# Altium schematic sheet schematic.schdoc
size 810 x 364 mm
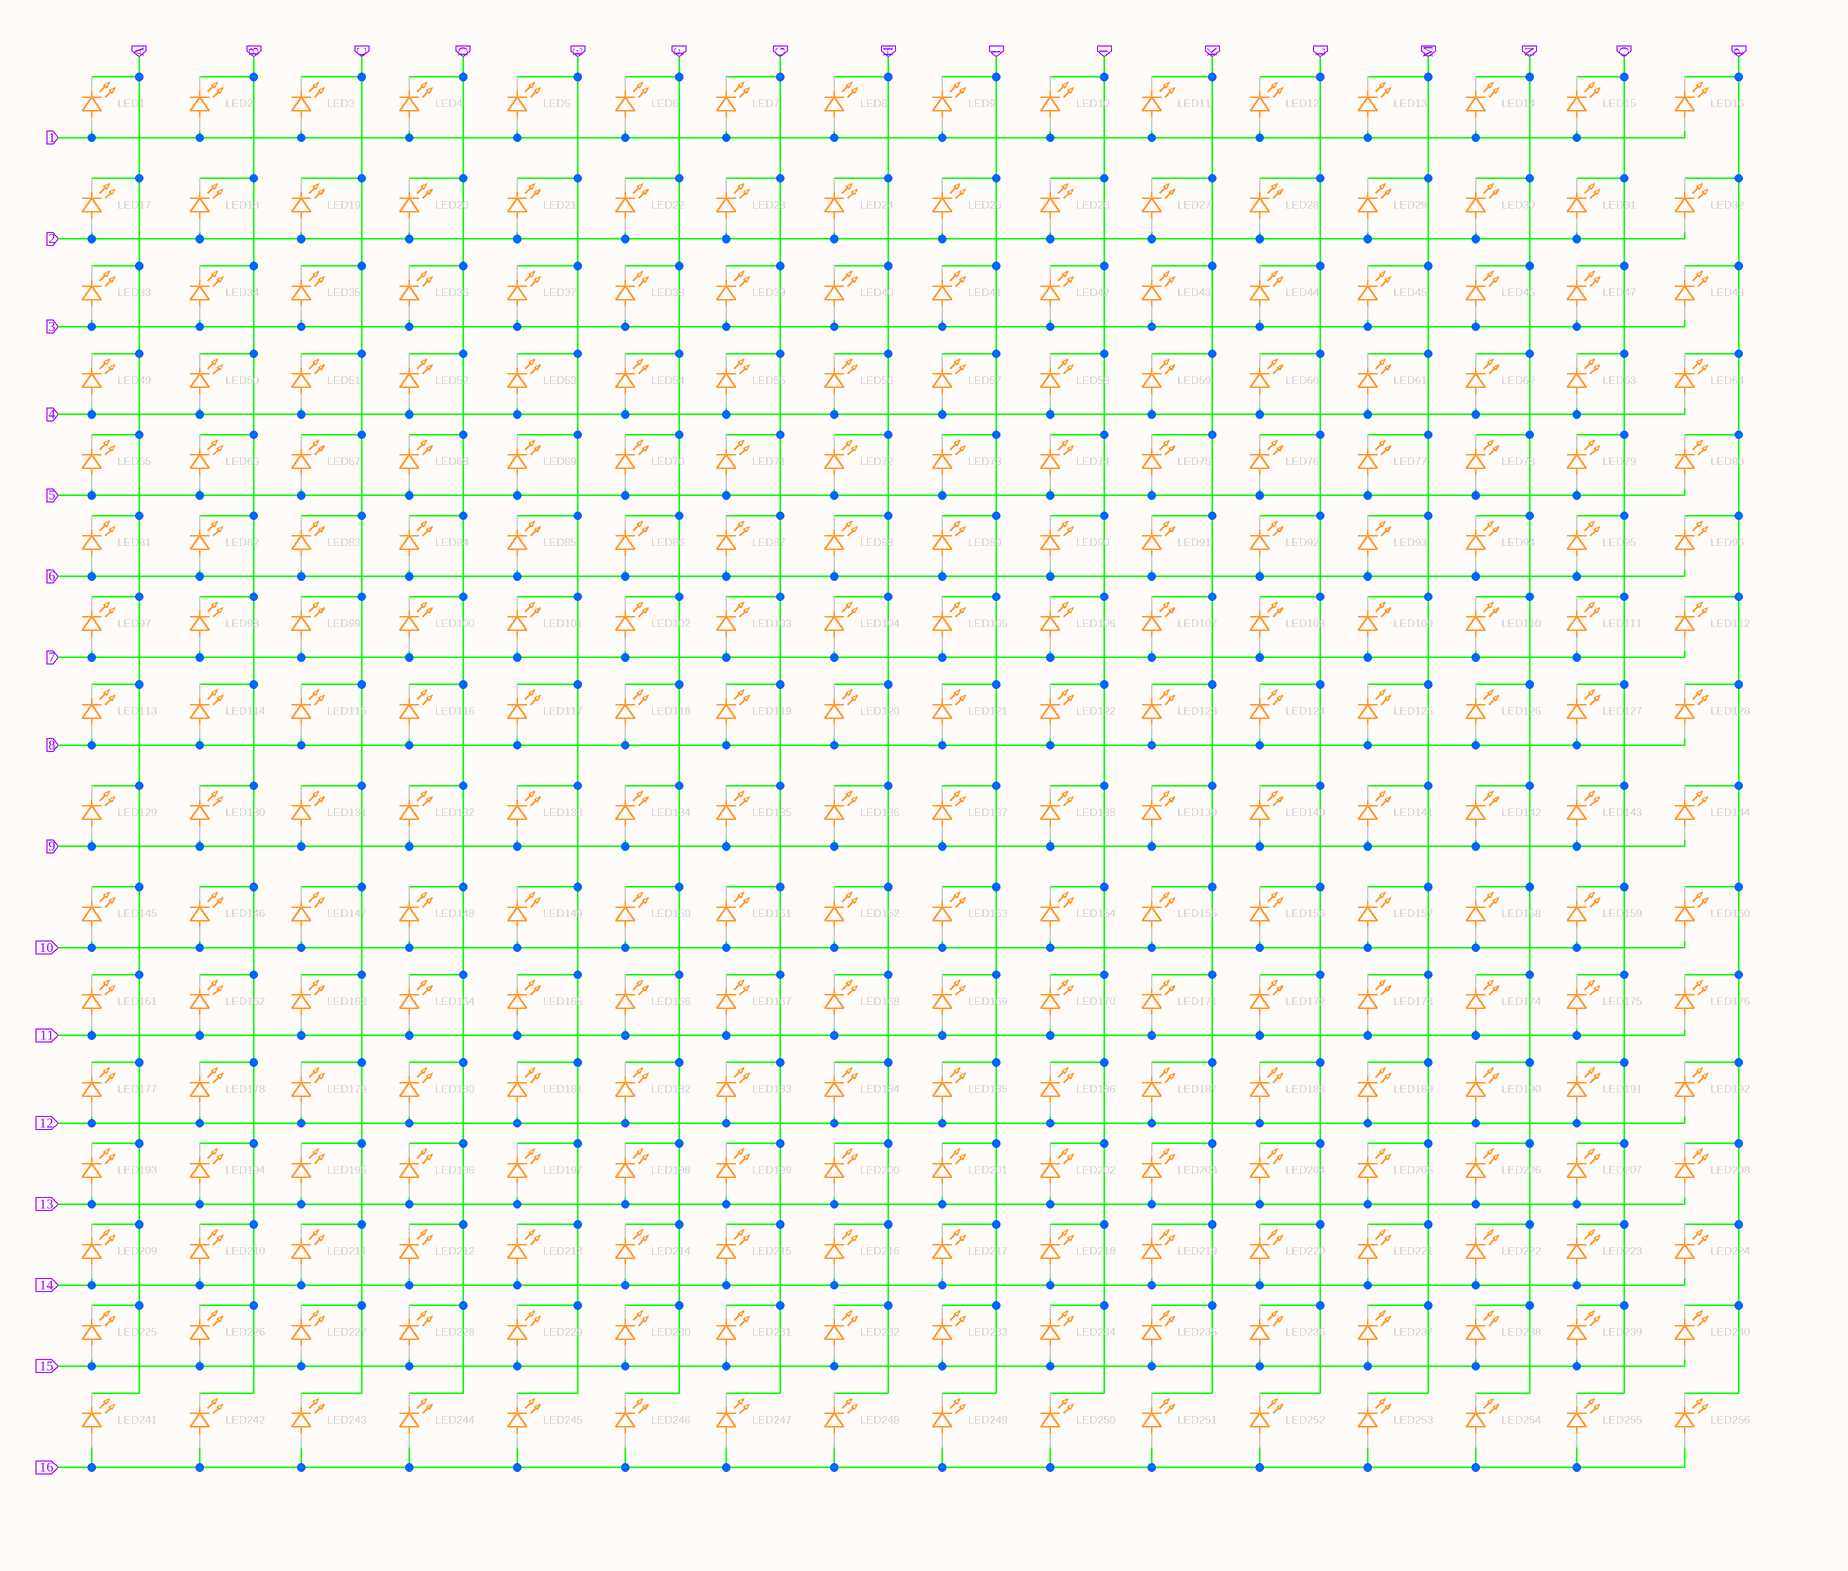
[diagram p0: schematic.schdoc, left]
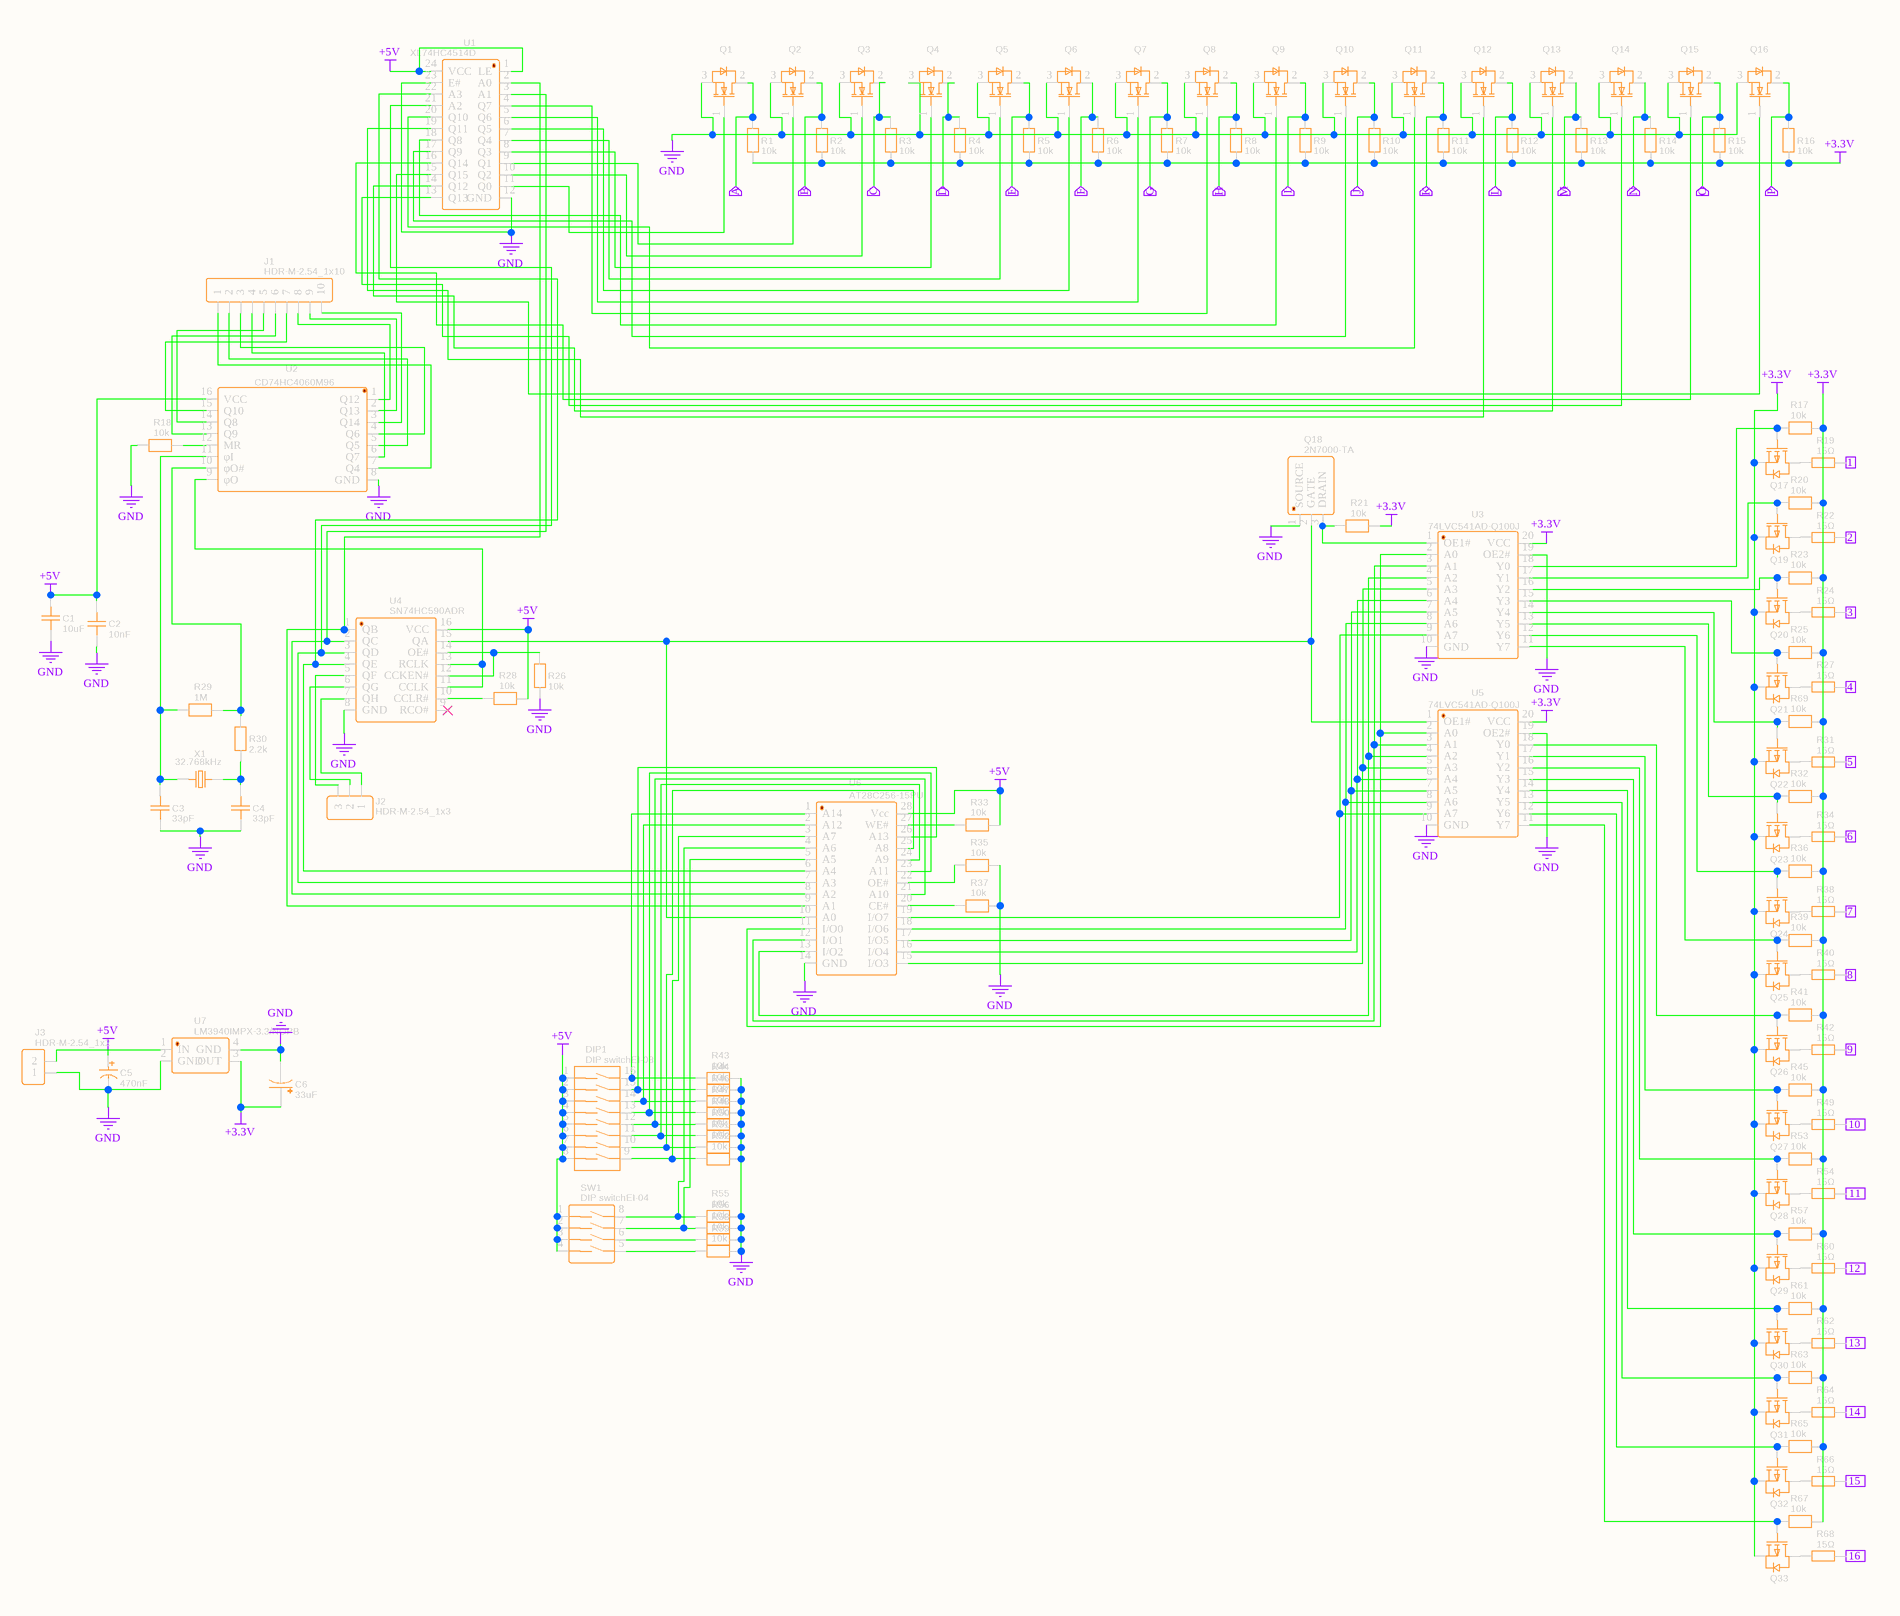
[diagram p1: schematic.schdoc, right]

## Parts
C1  10uF  [C1210]
C2  10nF  [C0805]
C3  33pF  [C0805]
C4  33pF  [C0805]
C5  470nF  [CAP-TH_BD4.0-P1.50-D0.8-FD]
C6  33uF  [CAP-TH_BD6.3-P2.50-D0.5-FD]
DIP1  DIP switchEI-08  [SW-TH_16P-L20.5-W6.0-P2.54]
J1  HDR-M-2.54_1x10  [HDR-M-2.54_1X10]
J2  HDR-M-2.54_1x3  [HDR-M-2.54_1X3]
J3  HDR-M-2.54_1x2  [HDR-M-2.54_1X2]
LED1  42-21A/GHC-YX1Y2N/1T  [LED-SMD_L3.2-W2.4-R_GREEN]  (value not drawn)
LED2  42-21A/GHC-YX1Y2N/1T  [LED-SMD_L3.2-W2.4-R_GREEN]  (value not drawn)
LED3  42-21A/GHC-YX1Y2N/1T  [LED-SMD_L3.2-W2.4-R_GREEN]  (value not drawn)
LED4  42-21A/GHC-YX1Y2N/1T  [LED-SMD_L3.2-W2.4-R_GREEN]  (value not drawn)
LED5  42-21A/GHC-YX1Y2N/1T  [LED-SMD_L3.2-W2.4-R_GREEN]  (value not drawn)
LED6  42-21A/GHC-YX1Y2N/1T  [LED-SMD_L3.2-W2.4-R_GREEN]  (value not drawn)
LED7  42-21A/GHC-YX1Y2N/1T  [LED-SMD_L3.2-W2.4-R_GREEN]  (value not drawn)
LED8  42-21A/GHC-YX1Y2N/1T  [LED-SMD_L3.2-W2.4-R_GREEN]  (value not drawn)
LED9  42-21A/GHC-YX1Y2N/1T  [LED-SMD_L3.2-W2.4-R_GREEN]  (value not drawn)
LED10  42-21A/GHC-YX1Y2N/1T  [LED-SMD_L3.2-W2.4-R_GREEN]  (value not drawn)
LED11  42-21A/GHC-YX1Y2N/1T  [LED-SMD_L3.2-W2.4-R_GREEN]  (value not drawn)
LED12  42-21A/GHC-YX1Y2N/1T  [LED-SMD_L3.2-W2.4-R_GREEN]  (value not drawn)
LED13  42-21A/GHC-YX1Y2N/1T  [LED-SMD_L3.2-W2.4-R_GREEN]  (value not drawn)
LED14  42-21A/GHC-YX1Y2N/1T  [LED-SMD_L3.2-W2.4-R_GREEN]  (value not drawn)
LED15  42-21A/GHC-YX1Y2N/1T  [LED-SMD_L3.2-W2.4-R_GREEN]  (value not drawn)
LED16  42-21A/GHC-YX1Y2N/1T  [LED-SMD_L3.2-W2.4-R_GREEN]  (value not drawn)
LED17  42-21A/GHC-YX1Y2N/1T  [LED-SMD_L3.2-W2.4-R_GREEN]  (value not drawn)
LED18  42-21A/GHC-YX1Y2N/1T  [LED-SMD_L3.2-W2.4-R_GREEN]  (value not drawn)
LED19  42-21A/GHC-YX1Y2N/1T  [LED-SMD_L3.2-W2.4-R_GREEN]  (value not drawn)
LED20  42-21A/GHC-YX1Y2N/1T  [LED-SMD_L3.2-W2.4-R_GREEN]  (value not drawn)
LED21  42-21A/GHC-YX1Y2N/1T  [LED-SMD_L3.2-W2.4-R_GREEN]  (value not drawn)
LED22  42-21A/GHC-YX1Y2N/1T  [LED-SMD_L3.2-W2.4-R_GREEN]  (value not drawn)
LED23  42-21A/GHC-YX1Y2N/1T  [LED-SMD_L3.2-W2.4-R_GREEN]  (value not drawn)
LED24  42-21A/GHC-YX1Y2N/1T  [LED-SMD_L3.2-W2.4-R_GREEN]  (value not drawn)
LED25  42-21A/GHC-YX1Y2N/1T  [LED-SMD_L3.2-W2.4-R_GREEN]  (value not drawn)
LED26  42-21A/GHC-YX1Y2N/1T  [LED-SMD_L3.2-W2.4-R_GREEN]  (value not drawn)
LED27  42-21A/GHC-YX1Y2N/1T  [LED-SMD_L3.2-W2.4-R_GREEN]  (value not drawn)
LED28  42-21A/GHC-YX1Y2N/1T  [LED-SMD_L3.2-W2.4-R_GREEN]  (value not drawn)
LED29  42-21A/GHC-YX1Y2N/1T  [LED-SMD_L3.2-W2.4-R_GREEN]  (value not drawn)
LED30  42-21A/GHC-YX1Y2N/1T  [LED-SMD_L3.2-W2.4-R_GREEN]  (value not drawn)
LED31  42-21A/GHC-YX1Y2N/1T  [LED-SMD_L3.2-W2.4-R_GREEN]  (value not drawn)
LED32  42-21A/GHC-YX1Y2N/1T  [LED-SMD_L3.2-W2.4-R_GREEN]  (value not drawn)
LED33  42-21A/GHC-YX1Y2N/1T  [LED-SMD_L3.2-W2.4-R_GREEN]  (value not drawn)
LED34  42-21A/GHC-YX1Y2N/1T  [LED-SMD_L3.2-W2.4-R_GREEN]  (value not drawn)
LED35  42-21A/GHC-YX1Y2N/1T  [LED-SMD_L3.2-W2.4-R_GREEN]  (value not drawn)
LED36  42-21A/GHC-YX1Y2N/1T  [LED-SMD_L3.2-W2.4-R_GREEN]  (value not drawn)
LED37  42-21A/GHC-YX1Y2N/1T  [LED-SMD_L3.2-W2.4-R_GREEN]  (value not drawn)
LED38  42-21A/GHC-YX1Y2N/1T  [LED-SMD_L3.2-W2.4-R_GREEN]  (value not drawn)
LED39  42-21A/GHC-YX1Y2N/1T  [LED-SMD_L3.2-W2.4-R_GREEN]  (value not drawn)
LED40  42-21A/GHC-YX1Y2N/1T  [LED-SMD_L3.2-W2.4-R_GREEN]  (value not drawn)
LED41  42-21A/GHC-YX1Y2N/1T  [LED-SMD_L3.2-W2.4-R_GREEN]  (value not drawn)
LED42  42-21A/GHC-YX1Y2N/1T  [LED-SMD_L3.2-W2.4-R_GREEN]  (value not drawn)
LED43  42-21A/GHC-YX1Y2N/1T  [LED-SMD_L3.2-W2.4-R_GREEN]  (value not drawn)
LED44  42-21A/GHC-YX1Y2N/1T  [LED-SMD_L3.2-W2.4-R_GREEN]  (value not drawn)
LED45  42-21A/GHC-YX1Y2N/1T  [LED-SMD_L3.2-W2.4-R_GREEN]  (value not drawn)
LED46  42-21A/GHC-YX1Y2N/1T  [LED-SMD_L3.2-W2.4-R_GREEN]  (value not drawn)
LED47  42-21A/GHC-YX1Y2N/1T  [LED-SMD_L3.2-W2.4-R_GREEN]  (value not drawn)
LED48  42-21A/GHC-YX1Y2N/1T  [LED-SMD_L3.2-W2.4-R_GREEN]  (value not drawn)
LED49  42-21A/GHC-YX1Y2N/1T  [LED-SMD_L3.2-W2.4-R_GREEN]  (value not drawn)
LED50  42-21A/GHC-YX1Y2N/1T  [LED-SMD_L3.2-W2.4-R_GREEN]  (value not drawn)
LED51  42-21A/GHC-YX1Y2N/1T  [LED-SMD_L3.2-W2.4-R_GREEN]  (value not drawn)
LED52  42-21A/GHC-YX1Y2N/1T  [LED-SMD_L3.2-W2.4-R_GREEN]  (value not drawn)
LED53  42-21A/GHC-YX1Y2N/1T  [LED-SMD_L3.2-W2.4-R_GREEN]  (value not drawn)
LED54  42-21A/GHC-YX1Y2N/1T  [LED-SMD_L3.2-W2.4-R_GREEN]  (value not drawn)
LED55  42-21A/GHC-YX1Y2N/1T  [LED-SMD_L3.2-W2.4-R_GREEN]  (value not drawn)
LED56  42-21A/GHC-YX1Y2N/1T  [LED-SMD_L3.2-W2.4-R_GREEN]  (value not drawn)
LED57  42-21A/GHC-YX1Y2N/1T  [LED-SMD_L3.2-W2.4-R_GREEN]  (value not drawn)
LED58  42-21A/GHC-YX1Y2N/1T  [LED-SMD_L3.2-W2.4-R_GREEN]  (value not drawn)
LED59  42-21A/GHC-YX1Y2N/1T  [LED-SMD_L3.2-W2.4-R_GREEN]  (value not drawn)
LED60  42-21A/GHC-YX1Y2N/1T  [LED-SMD_L3.2-W2.4-R_GREEN]  (value not drawn)
LED61  42-21A/GHC-YX1Y2N/1T  [LED-SMD_L3.2-W2.4-R_GREEN]  (value not drawn)
LED62  42-21A/GHC-YX1Y2N/1T  [LED-SMD_L3.2-W2.4-R_GREEN]  (value not drawn)
LED63  42-21A/GHC-YX1Y2N/1T  [LED-SMD_L3.2-W2.4-R_GREEN]  (value not drawn)
LED64  42-21A/GHC-YX1Y2N/1T  [LED-SMD_L3.2-W2.4-R_GREEN]  (value not drawn)
LED65  42-21A/GHC-YX1Y2N/1T  [LED-SMD_L3.2-W2.4-R_GREEN]  (value not drawn)
LED66  42-21A/GHC-YX1Y2N/1T  [LED-SMD_L3.2-W2.4-R_GREEN]  (value not drawn)
LED67  42-21A/GHC-YX1Y2N/1T  [LED-SMD_L3.2-W2.4-R_GREEN]  (value not drawn)
LED68  42-21A/GHC-YX1Y2N/1T  [LED-SMD_L3.2-W2.4-R_GREEN]  (value not drawn)
LED69  42-21A/GHC-YX1Y2N/1T  [LED-SMD_L3.2-W2.4-R_GREEN]  (value not drawn)
LED70  42-21A/GHC-YX1Y2N/1T  [LED-SMD_L3.2-W2.4-R_GREEN]  (value not drawn)
LED71  42-21A/GHC-YX1Y2N/1T  [LED-SMD_L3.2-W2.4-R_GREEN]  (value not drawn)
LED72  42-21A/GHC-YX1Y2N/1T  [LED-SMD_L3.2-W2.4-R_GREEN]  (value not drawn)
LED73  42-21A/GHC-YX1Y2N/1T  [LED-SMD_L3.2-W2.4-R_GREEN]  (value not drawn)
LED74  42-21A/GHC-YX1Y2N/1T  [LED-SMD_L3.2-W2.4-R_GREEN]  (value not drawn)
LED75  42-21A/GHC-YX1Y2N/1T  [LED-SMD_L3.2-W2.4-R_GREEN]  (value not drawn)
LED76  42-21A/GHC-YX1Y2N/1T  [LED-SMD_L3.2-W2.4-R_GREEN]  (value not drawn)
LED77  42-21A/GHC-YX1Y2N/1T  [LED-SMD_L3.2-W2.4-R_GREEN]  (value not drawn)
LED78  42-21A/GHC-YX1Y2N/1T  [LED-SMD_L3.2-W2.4-R_GREEN]  (value not drawn)
LED79  42-21A/GHC-YX1Y2N/1T  [LED-SMD_L3.2-W2.4-R_GREEN]  (value not drawn)
LED80  42-21A/GHC-YX1Y2N/1T  [LED-SMD_L3.2-W2.4-R_GREEN]  (value not drawn)
LED81  42-21A/GHC-YX1Y2N/1T  [LED-SMD_L3.2-W2.4-R_GREEN]  (value not drawn)
LED82  42-21A/GHC-YX1Y2N/1T  [LED-SMD_L3.2-W2.4-R_GREEN]  (value not drawn)
LED83  42-21A/GHC-YX1Y2N/1T  [LED-SMD_L3.2-W2.4-R_GREEN]  (value not drawn)
LED84  42-21A/GHC-YX1Y2N/1T  [LED-SMD_L3.2-W2.4-R_GREEN]  (value not drawn)
LED85  42-21A/GHC-YX1Y2N/1T  [LED-SMD_L3.2-W2.4-R_GREEN]  (value not drawn)
LED86  42-21A/GHC-YX1Y2N/1T  [LED-SMD_L3.2-W2.4-R_GREEN]  (value not drawn)
LED87  42-21A/GHC-YX1Y2N/1T  [LED-SMD_L3.2-W2.4-R_GREEN]  (value not drawn)
LED88  42-21A/GHC-YX1Y2N/1T  [LED-SMD_L3.2-W2.4-R_GREEN]  (value not drawn)
LED89  42-21A/GHC-YX1Y2N/1T  [LED-SMD_L3.2-W2.4-R_GREEN]  (value not drawn)
LED90  42-21A/GHC-YX1Y2N/1T  [LED-SMD_L3.2-W2.4-R_GREEN]  (value not drawn)
LED91  42-21A/GHC-YX1Y2N/1T  [LED-SMD_L3.2-W2.4-R_GREEN]  (value not drawn)
LED92  42-21A/GHC-YX1Y2N/1T  [LED-SMD_L3.2-W2.4-R_GREEN]  (value not drawn)
LED93  42-21A/GHC-YX1Y2N/1T  [LED-SMD_L3.2-W2.4-R_GREEN]  (value not drawn)
LED94  42-21A/GHC-YX1Y2N/1T  [LED-SMD_L3.2-W2.4-R_GREEN]  (value not drawn)
LED95  42-21A/GHC-YX1Y2N/1T  [LED-SMD_L3.2-W2.4-R_GREEN]  (value not drawn)
LED96  42-21A/GHC-YX1Y2N/1T  [LED-SMD_L3.2-W2.4-R_GREEN]  (value not drawn)
LED97  42-21A/GHC-YX1Y2N/1T  [LED-SMD_L3.2-W2.4-R_GREEN]  (value not drawn)
LED98  42-21A/GHC-YX1Y2N/1T  [LED-SMD_L3.2-W2.4-R_GREEN]  (value not drawn)
LED99  42-21A/GHC-YX1Y2N/1T  [LED-SMD_L3.2-W2.4-R_GREEN]  (value not drawn)
LED100  42-21A/GHC-YX1Y2N/1T  [LED-SMD_L3.2-W2.4-R_GREEN]  (value not drawn)
LED101  42-21A/GHC-YX1Y2N/1T  [LED-SMD_L3.2-W2.4-R_GREEN]  (value not drawn)
LED102  42-21A/GHC-YX1Y2N/1T  [LED-SMD_L3.2-W2.4-R_GREEN]  (value not drawn)
LED103  42-21A/GHC-YX1Y2N/1T  [LED-SMD_L3.2-W2.4-R_GREEN]  (value not drawn)
LED104  42-21A/GHC-YX1Y2N/1T  [LED-SMD_L3.2-W2.4-R_GREEN]  (value not drawn)
LED105  42-21A/GHC-YX1Y2N/1T  [LED-SMD_L3.2-W2.4-R_GREEN]  (value not drawn)
LED106  42-21A/GHC-YX1Y2N/1T  [LED-SMD_L3.2-W2.4-R_GREEN]  (value not drawn)
LED107  42-21A/GHC-YX1Y2N/1T  [LED-SMD_L3.2-W2.4-R_GREEN]  (value not drawn)
LED108  42-21A/GHC-YX1Y2N/1T  [LED-SMD_L3.2-W2.4-R_GREEN]  (value not drawn)
LED109  42-21A/GHC-YX1Y2N/1T  [LED-SMD_L3.2-W2.4-R_GREEN]  (value not drawn)
LED110  42-21A/GHC-YX1Y2N/1T  [LED-SMD_L3.2-W2.4-R_GREEN]  (value not drawn)
LED111  42-21A/GHC-YX1Y2N/1T  [LED-SMD_L3.2-W2.4-R_GREEN]  (value not drawn)
LED112  42-21A/GHC-YX1Y2N/1T  [LED-SMD_L3.2-W2.4-R_GREEN]  (value not drawn)
LED113  42-21A/GHC-YX1Y2N/1T  [LED-SMD_L3.2-W2.4-R_GREEN]  (value not drawn)
LED114  42-21A/GHC-YX1Y2N/1T  [LED-SMD_L3.2-W2.4-R_GREEN]  (value not drawn)
LED115  42-21A/GHC-YX1Y2N/1T  [LED-SMD_L3.2-W2.4-R_GREEN]  (value not drawn)
LED116  42-21A/GHC-YX1Y2N/1T  [LED-SMD_L3.2-W2.4-R_GREEN]  (value not drawn)
LED117  42-21A/GHC-YX1Y2N/1T  [LED-SMD_L3.2-W2.4-R_GREEN]  (value not drawn)
LED118  42-21A/GHC-YX1Y2N/1T  [LED-SMD_L3.2-W2.4-R_GREEN]  (value not drawn)
LED119  42-21A/GHC-YX1Y2N/1T  [LED-SMD_L3.2-W2.4-R_GREEN]  (value not drawn)
LED120  42-21A/GHC-YX1Y2N/1T  [LED-SMD_L3.2-W2.4-R_GREEN]  (value not drawn)
LED121  42-21A/GHC-YX1Y2N/1T  [LED-SMD_L3.2-W2.4-R_GREEN]  (value not drawn)
LED122  42-21A/GHC-YX1Y2N/1T  [LED-SMD_L3.2-W2.4-R_GREEN]  (value not drawn)
LED123  42-21A/GHC-YX1Y2N/1T  [LED-SMD_L3.2-W2.4-R_GREEN]  (value not drawn)
LED124  42-21A/GHC-YX1Y2N/1T  [LED-SMD_L3.2-W2.4-R_GREEN]  (value not drawn)
LED125  42-21A/GHC-YX1Y2N/1T  [LED-SMD_L3.2-W2.4-R_GREEN]  (value not drawn)
LED126  42-21A/GHC-YX1Y2N/1T  [LED-SMD_L3.2-W2.4-R_GREEN]  (value not drawn)
LED127  42-21A/GHC-YX1Y2N/1T  [LED-SMD_L3.2-W2.4-R_GREEN]  (value not drawn)
LED128  42-21A/GHC-YX1Y2N/1T  [LED-SMD_L3.2-W2.4-R_GREEN]  (value not drawn)
LED129  42-21A/GHC-YX1Y2N/1T  [LED-SMD_L3.2-W2.4-R_GREEN]  (value not drawn)
LED130  42-21A/GHC-YX1Y2N/1T  [LED-SMD_L3.2-W2.4-R_GREEN]  (value not drawn)
LED131  42-21A/GHC-YX1Y2N/1T  [LED-SMD_L3.2-W2.4-R_GREEN]  (value not drawn)
LED132  42-21A/GHC-YX1Y2N/1T  [LED-SMD_L3.2-W2.4-R_GREEN]  (value not drawn)
LED133  42-21A/GHC-YX1Y2N/1T  [LED-SMD_L3.2-W2.4-R_GREEN]  (value not drawn)
LED134  42-21A/GHC-YX1Y2N/1T  [LED-SMD_L3.2-W2.4-R_GREEN]  (value not drawn)
LED135  42-21A/GHC-YX1Y2N/1T  [LED-SMD_L3.2-W2.4-R_GREEN]  (value not drawn)
LED136  42-21A/GHC-YX1Y2N/1T  [LED-SMD_L3.2-W2.4-R_GREEN]  (value not drawn)
LED137  42-21A/GHC-YX1Y2N/1T  [LED-SMD_L3.2-W2.4-R_GREEN]  (value not drawn)
LED138  42-21A/GHC-YX1Y2N/1T  [LED-SMD_L3.2-W2.4-R_GREEN]  (value not drawn)
LED139  42-21A/GHC-YX1Y2N/1T  [LED-SMD_L3.2-W2.4-R_GREEN]  (value not drawn)
LED140  42-21A/GHC-YX1Y2N/1T  [LED-SMD_L3.2-W2.4-R_GREEN]  (value not drawn)
LED141  42-21A/GHC-YX1Y2N/1T  [LED-SMD_L3.2-W2.4-R_GREEN]  (value not drawn)
LED142  42-21A/GHC-YX1Y2N/1T  [LED-SMD_L3.2-W2.4-R_GREEN]  (value not drawn)
LED143  42-21A/GHC-YX1Y2N/1T  [LED-SMD_L3.2-W2.4-R_GREEN]  (value not drawn)
LED144  42-21A/GHC-YX1Y2N/1T  [LED-SMD_L3.2-W2.4-R_GREEN]  (value not drawn)
LED145  42-21A/GHC-YX1Y2N/1T  [LED-SMD_L3.2-W2.4-R_GREEN]  (value not drawn)
LED146  42-21A/GHC-YX1Y2N/1T  [LED-SMD_L3.2-W2.4-R_GREEN]  (value not drawn)
LED147  42-21A/GHC-YX1Y2N/1T  [LED-SMD_L3.2-W2.4-R_GREEN]  (value not drawn)
LED148  42-21A/GHC-YX1Y2N/1T  [LED-SMD_L3.2-W2.4-R_GREEN]  (value not drawn)
LED149  42-21A/GHC-YX1Y2N/1T  [LED-SMD_L3.2-W2.4-R_GREEN]  (value not drawn)
LED150  42-21A/GHC-YX1Y2N/1T  [LED-SMD_L3.2-W2.4-R_GREEN]  (value not drawn)
LED151  42-21A/GHC-YX1Y2N/1T  [LED-SMD_L3.2-W2.4-R_GREEN]  (value not drawn)
LED152  42-21A/GHC-YX1Y2N/1T  [LED-SMD_L3.2-W2.4-R_GREEN]  (value not drawn)
LED153  42-21A/GHC-YX1Y2N/1T  [LED-SMD_L3.2-W2.4-R_GREEN]  (value not drawn)
LED154  42-21A/GHC-YX1Y2N/1T  [LED-SMD_L3.2-W2.4-R_GREEN]  (value not drawn)
LED155  42-21A/GHC-YX1Y2N/1T  [LED-SMD_L3.2-W2.4-R_GREEN]  (value not drawn)
LED156  42-21A/GHC-YX1Y2N/1T  [LED-SMD_L3.2-W2.4-R_GREEN]  (value not drawn)
LED157  42-21A/GHC-YX1Y2N/1T  [LED-SMD_L3.2-W2.4-R_GREEN]  (value not drawn)
LED158  42-21A/GHC-YX1Y2N/1T  [LED-SMD_L3.2-W2.4-R_GREEN]  (value not drawn)
LED159  42-21A/GHC-YX1Y2N/1T  [LED-SMD_L3.2-W2.4-R_GREEN]  (value not drawn)
LED160  42-21A/GHC-YX1Y2N/1T  [LED-SMD_L3.2-W2.4-R_GREEN]  (value not drawn)
LED161  42-21A/GHC-YX1Y2N/1T  [LED-SMD_L3.2-W2.4-R_GREEN]  (value not drawn)
LED162  42-21A/GHC-YX1Y2N/1T  [LED-SMD_L3.2-W2.4-R_GREEN]  (value not drawn)
LED163  42-21A/GHC-YX1Y2N/1T  [LED-SMD_L3.2-W2.4-R_GREEN]  (value not drawn)
LED164  42-21A/GHC-YX1Y2N/1T  [LED-SMD_L3.2-W2.4-R_GREEN]  (value not drawn)
LED165  42-21A/GHC-YX1Y2N/1T  [LED-SMD_L3.2-W2.4-R_GREEN]  (value not drawn)
LED166  42-21A/GHC-YX1Y2N/1T  [LED-SMD_L3.2-W2.4-R_GREEN]  (value not drawn)
LED167  42-21A/GHC-YX1Y2N/1T  [LED-SMD_L3.2-W2.4-R_GREEN]  (value not drawn)
LED168  42-21A/GHC-YX1Y2N/1T  [LED-SMD_L3.2-W2.4-R_GREEN]  (value not drawn)
LED169  42-21A/GHC-YX1Y2N/1T  [LED-SMD_L3.2-W2.4-R_GREEN]  (value not drawn)
LED170  42-21A/GHC-YX1Y2N/1T  [LED-SMD_L3.2-W2.4-R_GREEN]  (value not drawn)
LED171  42-21A/GHC-YX1Y2N/1T  [LED-SMD_L3.2-W2.4-R_GREEN]  (value not drawn)
LED172  42-21A/GHC-YX1Y2N/1T  [LED-SMD_L3.2-W2.4-R_GREEN]  (value not drawn)
LED173  42-21A/GHC-YX1Y2N/1T  [LED-SMD_L3.2-W2.4-R_GREEN]  (value not drawn)
LED174  42-21A/GHC-YX1Y2N/1T  [LED-SMD_L3.2-W2.4-R_GREEN]  (value not drawn)
LED175  42-21A/GHC-YX1Y2N/1T  [LED-SMD_L3.2-W2.4-R_GREEN]  (value not drawn)
LED176  42-21A/GHC-YX1Y2N/1T  [LED-SMD_L3.2-W2.4-R_GREEN]  (value not drawn)
LED177  42-21A/GHC-YX1Y2N/1T  [LED-SMD_L3.2-W2.4-R_GREEN]  (value not drawn)
LED178  42-21A/GHC-YX1Y2N/1T  [LED-SMD_L3.2-W2.4-R_GREEN]  (value not drawn)
LED179  42-21A/GHC-YX1Y2N/1T  [LED-SMD_L3.2-W2.4-R_GREEN]  (value not drawn)
LED180  42-21A/GHC-YX1Y2N/1T  [LED-SMD_L3.2-W2.4-R_GREEN]  (value not drawn)
LED181  42-21A/GHC-YX1Y2N/1T  [LED-SMD_L3.2-W2.4-R_GREEN]  (value not drawn)
LED182  42-21A/GHC-YX1Y2N/1T  [LED-SMD_L3.2-W2.4-R_GREEN]  (value not drawn)
LED183  42-21A/GHC-YX1Y2N/1T  [LED-SMD_L3.2-W2.4-R_GREEN]  (value not drawn)
LED184  42-21A/GHC-YX1Y2N/1T  [LED-SMD_L3.2-W2.4-R_GREEN]  (value not drawn)
LED185  42-21A/GHC-YX1Y2N/1T  [LED-SMD_L3.2-W2.4-R_GREEN]  (value not drawn)
LED186  42-21A/GHC-YX1Y2N/1T  [LED-SMD_L3.2-W2.4-R_GREEN]  (value not drawn)
LED187  42-21A/GHC-YX1Y2N/1T  [LED-SMD_L3.2-W2.4-R_GREEN]  (value not drawn)
LED188  42-21A/GHC-YX1Y2N/1T  [LED-SMD_L3.2-W2.4-R_GREEN]  (value not drawn)
LED189  42-21A/GHC-YX1Y2N/1T  [LED-SMD_L3.2-W2.4-R_GREEN]  (value not drawn)
LED190  42-21A/GHC-YX1Y2N/1T  [LED-SMD_L3.2-W2.4-R_GREEN]  (value not drawn)
LED191  42-21A/GHC-YX1Y2N/1T  [LED-SMD_L3.2-W2.4-R_GREEN]  (value not drawn)
LED192  42-21A/GHC-YX1Y2N/1T  [LED-SMD_L3.2-W2.4-R_GREEN]  (value not drawn)
LED193  42-21A/GHC-YX1Y2N/1T  [LED-SMD_L3.2-W2.4-R_GREEN]  (value not drawn)
LED194  42-21A/GHC-YX1Y2N/1T  [LED-SMD_L3.2-W2.4-R_GREEN]  (value not drawn)
LED195  42-21A/GHC-YX1Y2N/1T  [LED-SMD_L3.2-W2.4-R_GREEN]  (value not drawn)
LED196  42-21A/GHC-YX1Y2N/1T  [LED-SMD_L3.2-W2.4-R_GREEN]  (value not drawn)
LED197  42-21A/GHC-YX1Y2N/1T  [LED-SMD_L3.2-W2.4-R_GREEN]  (value not drawn)
LED198  42-21A/GHC-YX1Y2N/1T  [LED-SMD_L3.2-W2.4-R_GREEN]  (value not drawn)
LED199  42-21A/GHC-YX1Y2N/1T  [LED-SMD_L3.2-W2.4-R_GREEN]  (value not drawn)
LED200  42-21A/GHC-YX1Y2N/1T  [LED-SMD_L3.2-W2.4-R_GREEN]  (value not drawn)
LED201  42-21A/GHC-YX1Y2N/1T  [LED-SMD_L3.2-W2.4-R_GREEN]  (value not drawn)
LED202  42-21A/GHC-YX1Y2N/1T  [LED-SMD_L3.2-W2.4-R_GREEN]  (value not drawn)
LED203  42-21A/GHC-YX1Y2N/1T  [LED-SMD_L3.2-W2.4-R_GREEN]  (value not drawn)
LED204  42-21A/GHC-YX1Y2N/1T  [LED-SMD_L3.2-W2.4-R_GREEN]  (value not drawn)
LED205  42-21A/GHC-YX1Y2N/1T  [LED-SMD_L3.2-W2.4-R_GREEN]  (value not drawn)
LED206  42-21A/GHC-YX1Y2N/1T  [LED-SMD_L3.2-W2.4-R_GREEN]  (value not drawn)
LED207  42-21A/GHC-YX1Y2N/1T  [LED-SMD_L3.2-W2.4-R_GREEN]  (value not drawn)
LED208  42-21A/GHC-YX1Y2N/1T  [LED-SMD_L3.2-W2.4-R_GREEN]  (value not drawn)
LED209  42-21A/GHC-YX1Y2N/1T  [LED-SMD_L3.2-W2.4-R_GREEN]  (value not drawn)
LED210  42-21A/GHC-YX1Y2N/1T  [LED-SMD_L3.2-W2.4-R_GREEN]  (value not drawn)
LED211  42-21A/GHC-YX1Y2N/1T  [LED-SMD_L3.2-W2.4-R_GREEN]  (value not drawn)
LED212  42-21A/GHC-YX1Y2N/1T  [LED-SMD_L3.2-W2.4-R_GREEN]  (value not drawn)
LED213  42-21A/GHC-YX1Y2N/1T  [LED-SMD_L3.2-W2.4-R_GREEN]  (value not drawn)
LED214  42-21A/GHC-YX1Y2N/1T  [LED-SMD_L3.2-W2.4-R_GREEN]  (value not drawn)
LED215  42-21A/GHC-YX1Y2N/1T  [LED-SMD_L3.2-W2.4-R_GREEN]  (value not drawn)
LED216  42-21A/GHC-YX1Y2N/1T  [LED-SMD_L3.2-W2.4-R_GREEN]  (value not drawn)
LED217  42-21A/GHC-YX1Y2N/1T  [LED-SMD_L3.2-W2.4-R_GREEN]  (value not drawn)
LED218  42-21A/GHC-YX1Y2N/1T  [LED-SMD_L3.2-W2.4-R_GREEN]  (value not drawn)
LED219  42-21A/GHC-YX1Y2N/1T  [LED-SMD_L3.2-W2.4-R_GREEN]  (value not drawn)
LED220  42-21A/GHC-YX1Y2N/1T  [LED-SMD_L3.2-W2.4-R_GREEN]  (value not drawn)
LED221  42-21A/GHC-YX1Y2N/1T  [LED-SMD_L3.2-W2.4-R_GREEN]  (value not drawn)
LED222  42-21A/GHC-YX1Y2N/1T  [LED-SMD_L3.2-W2.4-R_GREEN]  (value not drawn)
LED223  42-21A/GHC-YX1Y2N/1T  [LED-SMD_L3.2-W2.4-R_GREEN]  (value not drawn)
LED224  42-21A/GHC-YX1Y2N/1T  [LED-SMD_L3.2-W2.4-R_GREEN]  (value not drawn)
LED225  42-21A/GHC-YX1Y2N/1T  [LED-SMD_L3.2-W2.4-R_GREEN]  (value not drawn)
LED226  42-21A/GHC-YX1Y2N/1T  [LED-SMD_L3.2-W2.4-R_GREEN]  (value not drawn)
LED227  42-21A/GHC-YX1Y2N/1T  [LED-SMD_L3.2-W2.4-R_GREEN]  (value not drawn)
LED228  42-21A/GHC-YX1Y2N/1T  [LED-SMD_L3.2-W2.4-R_GREEN]  (value not drawn)
LED229  42-21A/GHC-YX1Y2N/1T  [LED-SMD_L3.2-W2.4-R_GREEN]  (value not drawn)
LED230  42-21A/GHC-YX1Y2N/1T  [LED-SMD_L3.2-W2.4-R_GREEN]  (value not drawn)
LED231  42-21A/GHC-YX1Y2N/1T  [LED-SMD_L3.2-W2.4-R_GREEN]  (value not drawn)
LED232  42-21A/GHC-YX1Y2N/1T  [LED-SMD_L3.2-W2.4-R_GREEN]  (value not drawn)
LED233  42-21A/GHC-YX1Y2N/1T  [LED-SMD_L3.2-W2.4-R_GREEN]  (value not drawn)
LED234  42-21A/GHC-YX1Y2N/1T  [LED-SMD_L3.2-W2.4-R_GREEN]  (value not drawn)
LED235  42-21A/GHC-YX1Y2N/1T  [LED-SMD_L3.2-W2.4-R_GREEN]  (value not drawn)
LED236  42-21A/GHC-YX1Y2N/1T  [LED-SMD_L3.2-W2.4-R_GREEN]  (value not drawn)
LED237  42-21A/GHC-YX1Y2N/1T  [LED-SMD_L3.2-W2.4-R_GREEN]  (value not drawn)
LED238  42-21A/GHC-YX1Y2N/1T  [LED-SMD_L3.2-W2.4-R_GREEN]  (value not drawn)
LED239  42-21A/GHC-YX1Y2N/1T  [LED-SMD_L3.2-W2.4-R_GREEN]  (value not drawn)
LED240  42-21A/GHC-YX1Y2N/1T  [LED-SMD_L3.2-W2.4-R_GREEN]  (value not drawn)
LED241  42-21A/GHC-YX1Y2N/1T  [LED-SMD_L3.2-W2.4-R_GREEN]  (value not drawn)
LED242  42-21A/GHC-YX1Y2N/1T  [LED-SMD_L3.2-W2.4-R_GREEN]  (value not drawn)
LED243  42-21A/GHC-YX1Y2N/1T  [LED-SMD_L3.2-W2.4-R_GREEN]  (value not drawn)
LED244  42-21A/GHC-YX1Y2N/1T  [LED-SMD_L3.2-W2.4-R_GREEN]  (value not drawn)
LED245  42-21A/GHC-YX1Y2N/1T  [LED-SMD_L3.2-W2.4-R_GREEN]  (value not drawn)
LED246  42-21A/GHC-YX1Y2N/1T  [LED-SMD_L3.2-W2.4-R_GREEN]  (value not drawn)
LED247  42-21A/GHC-YX1Y2N/1T  [LED-SMD_L3.2-W2.4-R_GREEN]  (value not drawn)
LED248  42-21A/GHC-YX1Y2N/1T  [LED-SMD_L3.2-W2.4-R_GREEN]  (value not drawn)
LED249  42-21A/GHC-YX1Y2N/1T  [LED-SMD_L3.2-W2.4-R_GREEN]  (value not drawn)
LED250  42-21A/GHC-YX1Y2N/1T  [LED-SMD_L3.2-W2.4-R_GREEN]  (value not drawn)
LED251  42-21A/GHC-YX1Y2N/1T  [LED-SMD_L3.2-W2.4-R_GREEN]  (value not drawn)
LED252  42-21A/GHC-YX1Y2N/1T  [LED-SMD_L3.2-W2.4-R_GREEN]  (value not drawn)
LED253  42-21A/GHC-YX1Y2N/1T  [LED-SMD_L3.2-W2.4-R_GREEN]  (value not drawn)
LED254  42-21A/GHC-YX1Y2N/1T  [LED-SMD_L3.2-W2.4-R_GREEN]  (value not drawn)
LED255  42-21A/GHC-YX1Y2N/1T  [LED-SMD_L3.2-W2.4-R_GREEN]  (value not drawn)
LED256  42-21A/GHC-YX1Y2N/1T  [LED-SMD_L3.2-W2.4-R_GREEN]  (value not drawn)
Q1  IRLZ44NPBF-MNS  [TO-220-3_L10.0-W4.5-P2.54-L]  (value not drawn)
Q2  IRLZ44NPBF-MNS  [TO-220-3_L10.0-W4.5-P2.54-L]  (value not drawn)
Q3  IRLZ44NPBF-MNS  [TO-220-3_L10.0-W4.5-P2.54-L]  (value not drawn)
Q4  IRLZ44NPBF-MNS  [TO-220-3_L10.0-W4.5-P2.54-L]  (value not drawn)
Q5  IRLZ44NPBF-MNS  [TO-220-3_L10.0-W4.5-P2.54-L]  (value not drawn)
Q6  IRLZ44NPBF-MNS  [TO-220-3_L10.0-W4.5-P2.54-L]  (value not drawn)
Q7  IRLZ44NPBF-MNS  [TO-220-3_L10.0-W4.5-P2.54-L]  (value not drawn)
Q8  IRLZ44NPBF-MNS  [TO-220-3_L10.0-W4.5-P2.54-L]  (value not drawn)
Q9  IRLZ44NPBF-MNS  [TO-220-3_L10.0-W4.5-P2.54-L]  (value not drawn)
Q10  IRLZ44NPBF-MNS  [TO-220-3_L10.0-W4.5-P2.54-L]  (value not drawn)
Q11  IRLZ44NPBF-MNS  [TO-220-3_L10.0-W4.5-P2.54-L]  (value not drawn)
Q12  IRLZ44NPBF-MNS  [TO-220-3_L10.0-W4.5-P2.54-L]  (value not drawn)
Q13  IRLZ44NPBF-MNS  [TO-220-3_L10.0-W4.5-P2.54-L]  (value not drawn)
Q14  IRLZ44NPBF-MNS  [TO-220-3_L10.0-W4.5-P2.54-L]  (value not drawn)
Q15  IRLZ44NPBF-MNS  [TO-220-3_L10.0-W4.5-P2.54-L]  (value not drawn)
Q16  IRLZ44NPBF-MNS  [TO-220-3_L10.0-W4.5-P2.54-L]  (value not drawn)
Q17  AO3401CI-ES  [SOT-23-3_L2.9-W1.3-P1.90-LS2.4-BR]  (value not drawn)
Q18  2N7000-TA  [TO-92-3_L4.5-W3.5-P1.27-L]
Q19  AO3401CI-ES  [SOT-23-3_L2.9-W1.3-P1.90-LS2.4-BR]  (value not drawn)
Q20  AO3401CI-ES  [SOT-23-3_L2.9-W1.3-P1.90-LS2.4-BR]  (value not drawn)
Q21  AO3401CI-ES  [SOT-23-3_L2.9-W1.3-P1.90-LS2.4-BR]  (value not drawn)
Q22  AO3401CI-ES  [SOT-23-3_L2.9-W1.3-P1.90-LS2.4-BR]  (value not drawn)
Q23  AO3401CI-ES  [SOT-23-3_L2.9-W1.3-P1.90-LS2.4-BR]  (value not drawn)
Q24  AO3401CI-ES  [SOT-23-3_L2.9-W1.3-P1.90-LS2.4-BR]  (value not drawn)
Q25  AO3401CI-ES  [SOT-23-3_L2.9-W1.3-P1.90-LS2.4-BR]  (value not drawn)
Q26  AO3401CI-ES  [SOT-23-3_L2.9-W1.3-P1.90-LS2.4-BR]  (value not drawn)
Q27  AO3401CI-ES  [SOT-23-3_L2.9-W1.3-P1.90-LS2.4-BR]  (value not drawn)
Q28  AO3401CI-ES  [SOT-23-3_L2.9-W1.3-P1.90-LS2.4-BR]  (value not drawn)
Q29  AO3401CI-ES  [SOT-23-3_L2.9-W1.3-P1.90-LS2.4-BR]  (value not drawn)
Q30  AO3401CI-ES  [SOT-23-3_L2.9-W1.3-P1.90-LS2.4-BR]  (value not drawn)
Q31  AO3401CI-ES  [SOT-23-3_L2.9-W1.3-P1.90-LS2.4-BR]  (value not drawn)
Q32  AO3401CI-ES  [SOT-23-3_L2.9-W1.3-P1.90-LS2.4-BR]  (value not drawn)
Q33  AO3401CI-ES  [SOT-23-3_L2.9-W1.3-P1.90-LS2.4-BR]  (value not drawn)
R1  10k  [R0603]
R2  10k  [R0603]
R3  10k  [R0603]
R4  10k  [R0603]
R5  10k  [R0603]
R6  10k  [R0603]
R7  10k  [R0603]
R8  10k  [R0603]
R9  10k  [R0603]
R10  10k  [R0603]
R11  10k  [R0603]
R12  10k  [R0603]
R13  10k  [R0603]
R14  10k  [R0603]
R15  10k  [R0603]
R16  10k  [R0603]
R17  10k  [R0603]
R18  10k  [R0603]
R19  15Ω  [RES-TH_BD2.3-L6.5-P10.50-D0.5]
R20  10k  [R0603]
R21  10k  [R0603]
R22  15Ω  [RES-TH_BD2.3-L6.5-P10.50-D0.5]
R23  10k  [R0603]
R24  15Ω  [RES-TH_BD2.3-L6.5-P10.50-D0.5]
R25  10k  [R0603]
R26  10k  [R0603]
R27  15Ω  [RES-TH_BD2.3-L6.5-P10.50-D0.5]
R28  10k  [R0603]
R29  1M  [R0603]
R30  2.2k  [R0603]
R31  15Ω  [RES-TH_BD2.3-L6.5-P10.50-D0.5]
R32  10k  [R0603]
R33  10k  [R0603]
R34  15Ω  [RES-TH_BD2.3-L6.5-P10.50-D0.5]
R35  10k  [R0603]
R36  10k  [R0603]
R37  10k  [R0603]
R38  15Ω  [RES-TH_BD2.3-L6.5-P10.50-D0.5]
R39  10k  [R0603]
R40  15Ω  [RES-TH_BD2.3-L6.5-P10.50-D0.5]
R41  10k  [R0603]
R42  15Ω  [RES-TH_BD2.3-L6.5-P10.50-D0.5]
R43  10k  [R0603]
R44  10k  [R0603]
R45  10k  [R0603]
R46  10k  [R0603]
R47  10k  [R0603]
R48  10k  [R0603]
R49  15Ω  [RES-TH_BD2.3-L6.5-P10.50-D0.5]
R50  10k  [R0603]
R51  10k  [R0603]
R52  10k  [R0603]
R53  10k  [R0603]
R54  15Ω  [RES-TH_BD2.3-L6.5-P10.50-D0.5]
R55  10k  [R0603]
R56  10k  [R0603]
R57  10k  [R0603]
R58  10k  [R0603]
R59  10k  [R0603]
R60  15Ω  [RES-TH_BD2.3-L6.5-P10.50-D0.5]
R61  10k  [R0603]
R62  15Ω  [RES-TH_BD2.3-L6.5-P10.50-D0.5]
R63  10k  [R0603]
R64  15Ω  [RES-TH_BD2.3-L6.5-P10.50-D0.5]
R65  10k  [R0603]
R66  15Ω  [RES-TH_BD2.3-L6.5-P10.50-D0.5]
R67  10k  [R0603]
R68  15Ω  [RES-TH_BD2.3-L6.5-P10.50-D0.5]
R69  10k  [R0603]
SW1  DIP switchEI-04  [SW-TH_DIPSWITCHEI-04]
U1  XL74HC4514D  [SOP-24_L15.3-W7.6-LS10.3-P1.27-BL]
U2  CD74HC4060M96  [SOIC-16_L10.8-W4.5-P1.27-LS6.8-BL]
U3  74LVC541AD-Q100J  [SO-20_L12.8-W7.5-P1.27-LS10.3-BL]
U4  SN74HC590ADR  [SOIC-16_L9.9-W3.9-P1.27-LS6.0-BL]
U5  74LVC541AD-Q100J  [SO-20_L12.8-W7.5-P1.27-LS10.3-BL]
U6  AT28C256-15PU  [PDIP-28_L37.0-W13.5-P2.54-LS15.6-BL]
U7  LM3940IMPX-3.3/NOPB  [SOT-223-4_L6.5-W3.5-P2.30-LS7.0-BR]
X1  32.768kHz  [DT-38_BD3.1-P1.1]

## Ports
1 (in), 2 (in), 3 (in), 4 (in), 5 (in), 6 (in), 7 (in), 8 (in), 9 (in), 10 (in), 11 (in), 12 (in), 13 (in), 14 (in), 15 (in), 16 (in), A (in), B (in), C (in), D (in), E (in), F (in), G (in), H (in), I (in), J (in), K (in), L (in), M (in), N (in), O (in), P (in)

## Nets
+3.3V: C6.1 Q17.2(S) Q19.2(S) Q20.2(S) Q21.2(S) Q22.2(S) Q23.2(S) Q24.2(S) Q25.2(S) Q26.2(S) Q27.2(S) Q28.2(S) Q29.2(S) Q30.2(S) Q31.2(S) Q32.2(S) Q33.2(S) R1.1 R2.1 R3.1 R4.1 R5.1 R6.1 R7.1 R8.1 R9.1 R10.1 R11.1 R12.1 R13.1 R14.1 R15.1 R16.1 R17.1 R20.2 R21.2 R23.2 R25.2 R32.2 R36.2 R39.2 R41.2 R45.2 R53.2 R57.2 R61.2 R63.2 R65.2 R67.2 R69.2 U3.20(VCC) U5.20(VCC) U7.3(OUT)
+5V: C1.2 C2.2 C5.1 DIP1.1 DIP1.2 DIP1.3 DIP1.4 DIP1.5 DIP1.6 DIP1.7 DIP1.8 J3.2 R28.2 R33.2 SW1.1 SW1.2 SW1.3 SW1.4 U1.1(LE) U1.24(VCC) U2.16(VCC) U4.16(VCC) U6.28(Vcc) U7.1(IN)
GND: C1.1 C2.1 C3.1 C4.1 C5.2 C6.2 J3.1 Q1.3(S) Q2.3(S) Q3.3(S) Q4.3(S) Q5.3(S) Q6.3(S) Q7.3(S) Q8.3(S) Q9.3(S) Q10.3(S) Q11.3(S) Q12.3(S) Q13.3(S) Q14.3(S) Q15.3(S) Q16.3(S) Q18.1(SOURCE) R18.1 R26.1 R35.2 R37.2 R43.2 R44.2 R46.2 R47.2 R48.2 R50.2 R51.2 R52.2 R55.2 R56.2 R58.2 R59.2 U1.12(GND) U1.23(E#) U2.8(GND) U3.10(GND) U3.19(OE2#) U4.8(GND) U5.10(GND) U5.19(OE2#) U6.14(GND) U7.2(GND) U7.4(GND)
1: LED1.2(A) LED2.2(A) LED3.2(A) LED4.2(A) LED5.2(A) LED6.2(A) LED7.2(A) LED8.2(A) LED9.2(A) LED10.2(A) LED11.2(A) LED12.2(A) LED13.2(A) LED14.2(A) LED15.2(A) LED16.2(A) R19.2 ; port 1
2: LED17.2(A) LED18.2(A) LED19.2(A) LED20.2(A) LED21.2(A) LED22.2(A) LED23.2(A) LED24.2(A) LED25.2(A) LED26.2(A) LED27.2(A) LED28.2(A) LED29.2(A) LED30.2(A) LED31.2(A) LED32.2(A) R22.2 ; port 2
3: LED33.2(A) LED34.2(A) LED35.2(A) LED36.2(A) LED37.2(A) LED38.2(A) LED39.2(A) LED40.2(A) LED41.2(A) LED42.2(A) LED43.2(A) LED44.2(A) LED45.2(A) LED46.2(A) LED47.2(A) LED48.2(A) R24.2 ; port 3
4: LED49.2(A) LED50.2(A) LED51.2(A) LED52.2(A) LED53.2(A) LED54.2(A) LED55.2(A) LED56.2(A) LED57.2(A) LED58.2(A) LED59.2(A) LED60.2(A) LED61.2(A) LED62.2(A) LED63.2(A) LED64.2(A) R27.2 ; port 4
5: LED65.2(A) LED66.2(A) LED67.2(A) LED68.2(A) LED69.2(A) LED70.2(A) LED71.2(A) LED72.2(A) LED73.2(A) LED74.2(A) LED75.2(A) LED76.2(A) LED77.2(A) LED78.2(A) LED79.2(A) LED80.2(A) R31.2 ; port 5
6: LED81.2(A) LED82.2(A) LED83.2(A) LED84.2(A) LED85.2(A) LED86.2(A) LED87.2(A) LED88.2(A) LED89.2(A) LED90.2(A) LED91.2(A) LED92.2(A) LED93.2(A) LED94.2(A) LED95.2(A) LED96.2(A) R34.2 ; port 6
7: LED97.2(A) LED98.2(A) LED99.2(A) LED100.2(A) LED101.2(A) LED102.2(A) LED103.2(A) LED104.2(A) LED105.2(A) LED106.2(A) LED107.2(A) LED108.2(A) LED109.2(A) LED110.2(A) LED111.2(A) LED112.2(A) R38.2 ; port 7
8: LED113.2(A) LED114.2(A) LED115.2(A) LED116.2(A) LED117.2(A) LED118.2(A) LED119.2(A) LED120.2(A) LED121.2(A) LED122.2(A) LED123.2(A) LED124.2(A) LED125.2(A) LED126.2(A) LED127.2(A) LED128.2(A) R40.2 ; port 8
9: LED129.2(A) LED130.2(A) LED131.2(A) LED132.2(A) LED133.2(A) LED134.2(A) LED135.2(A) LED136.2(A) LED137.2(A) LED138.2(A) LED139.2(A) LED140.2(A) LED141.2(A) LED142.2(A) LED143.2(A) LED144.2(A) R42.2 ; port 9
10: LED145.2(A) LED146.2(A) LED147.2(A) LED148.2(A) LED149.2(A) LED150.2(A) LED151.2(A) LED152.2(A) LED153.2(A) LED154.2(A) LED155.2(A) LED156.2(A) LED157.2(A) LED158.2(A) LED159.2(A) LED160.2(A) R49.2 ; port 10
11: LED161.2(A) LED162.2(A) LED163.2(A) LED164.2(A) LED165.2(A) LED166.2(A) LED167.2(A) LED168.2(A) LED169.2(A) LED170.2(A) LED171.2(A) LED172.2(A) LED173.2(A) LED174.2(A) LED175.2(A) LED176.2(A) R54.2 ; port 11
12: LED177.2(A) LED178.2(A) LED179.2(A) LED180.2(A) LED181.2(A) LED182.2(A) LED183.2(A) LED184.2(A) LED185.2(A) LED186.2(A) LED187.2(A) LED188.2(A) LED189.2(A) LED190.2(A) LED191.2(A) LED192.2(A) R60.2 ; port 12
13: LED193.2(A) LED194.2(A) LED195.2(A) LED196.2(A) LED197.2(A) LED198.2(A) LED199.2(A) LED200.2(A) LED201.2(A) LED202.2(A) LED203.2(A) LED204.2(A) LED205.2(A) LED206.2(A) LED207.2(A) LED208.2(A) R62.2 ; port 13
14: LED209.2(A) LED210.2(A) LED211.2(A) LED212.2(A) LED213.2(A) LED214.2(A) LED215.2(A) LED216.2(A) LED217.2(A) LED218.2(A) LED219.2(A) LED220.2(A) LED221.2(A) LED222.2(A) LED223.2(A) LED224.2(A) R64.2 ; port 14
15: LED225.2(A) LED226.2(A) LED227.2(A) LED228.2(A) LED229.2(A) LED230.2(A) LED231.2(A) LED232.2(A) LED233.2(A) LED234.2(A) LED235.2(A) LED236.2(A) LED237.2(A) LED238.2(A) LED239.2(A) LED240.2(A) R66.2 ; port 15
16: LED241.2(A) LED242.2(A) LED243.2(A) LED244.2(A) LED245.2(A) LED246.2(A) LED247.2(A) LED248.2(A) LED249.2(A) LED250.2(A) LED251.2(A) LED252.2(A) LED253.2(A) LED254.2(A) LED255.2(A) LED256.2(A) R68.2 ; port 16
A: LED1.1(K) LED17.1(K) LED33.1(K) LED49.1(K) LED65.1(K) LED81.1(K) LED97.1(K) LED113.1(K) LED129.1(K) LED145.1(K) LED161.1(K) LED177.1(K) LED193.1(K) LED209.1(K) LED225.1(K) LED241.1(K) Q1.2(D) R1.2 ; port A
B: LED2.1(K) LED18.1(K) LED34.1(K) LED50.1(K) LED66.1(K) LED82.1(K) LED98.1(K) LED114.1(K) LED130.1(K) LED146.1(K) LED162.1(K) LED178.1(K) LED194.1(K) LED210.1(K) LED226.1(K) LED242.1(K) Q2.2(D) R2.2 ; port B
C: LED3.1(K) LED19.1(K) LED35.1(K) LED51.1(K) LED67.1(K) LED83.1(K) LED99.1(K) LED115.1(K) LED131.1(K) LED147.1(K) LED163.1(K) LED179.1(K) LED195.1(K) LED211.1(K) LED227.1(K) LED243.1(K) Q3.2(D) R3.2 ; port C
D: LED4.1(K) LED20.1(K) LED36.1(K) LED52.1(K) LED68.1(K) LED84.1(K) LED100.1(K) LED116.1(K) LED132.1(K) LED148.1(K) LED164.1(K) LED180.1(K) LED196.1(K) LED212.1(K) LED228.1(K) LED244.1(K) Q4.2(D) R4.2 ; port D
E: LED5.1(K) LED21.1(K) LED37.1(K) LED53.1(K) LED69.1(K) LED85.1(K) LED101.1(K) LED117.1(K) LED133.1(K) LED149.1(K) LED165.1(K) LED181.1(K) LED197.1(K) LED213.1(K) LED229.1(K) LED245.1(K) Q5.2(D) R5.2 ; port E
F: LED6.1(K) LED22.1(K) LED38.1(K) LED54.1(K) LED70.1(K) LED86.1(K) LED102.1(K) LED118.1(K) LED134.1(K) LED150.1(K) LED166.1(K) LED182.1(K) LED198.1(K) LED214.1(K) LED230.1(K) LED246.1(K) Q6.2(D) R6.2 ; port F
G: LED7.1(K) LED23.1(K) LED39.1(K) LED55.1(K) LED71.1(K) LED87.1(K) LED103.1(K) LED119.1(K) LED135.1(K) LED151.1(K) LED167.1(K) LED183.1(K) LED199.1(K) LED215.1(K) LED231.1(K) LED247.1(K) Q7.2(D) R7.2 ; port G
H: LED8.1(K) LED24.1(K) LED40.1(K) LED56.1(K) LED72.1(K) LED88.1(K) LED104.1(K) LED120.1(K) LED136.1(K) LED152.1(K) LED168.1(K) LED184.1(K) LED200.1(K) LED216.1(K) LED232.1(K) LED248.1(K) Q8.2(D) R8.2 ; port H
I: LED9.1(K) LED25.1(K) LED41.1(K) LED57.1(K) LED73.1(K) LED89.1(K) LED105.1(K) LED121.1(K) LED137.1(K) LED153.1(K) LED169.1(K) LED185.1(K) LED201.1(K) LED217.1(K) LED233.1(K) LED249.1(K) Q9.2(D) R9.2 ; port I
J: LED10.1(K) LED26.1(K) LED42.1(K) LED58.1(K) LED74.1(K) LED90.1(K) LED106.1(K) LED122.1(K) LED138.1(K) LED154.1(K) LED170.1(K) LED186.1(K) LED202.1(K) LED218.1(K) LED234.1(K) LED250.1(K) Q10.2(D) R10.2 ; port J
K: LED11.1(K) LED27.1(K) LED43.1(K) LED59.1(K) LED75.1(K) LED91.1(K) LED107.1(K) LED123.1(K) LED139.1(K) LED155.1(K) LED171.1(K) LED187.1(K) LED203.1(K) LED219.1(K) LED235.1(K) LED251.1(K) Q11.2(D) R11.2 ; port K
L: LED12.1(K) LED28.1(K) LED44.1(K) LED60.1(K) LED76.1(K) LED92.1(K) LED108.1(K) LED124.1(K) LED140.1(K) LED156.1(K) LED172.1(K) LED188.1(K) LED204.1(K) LED220.1(K) LED236.1(K) LED252.1(K) Q12.2(D) R12.2 ; port L
M: LED13.1(K) LED29.1(K) LED45.1(K) LED61.1(K) LED77.1(K) LED93.1(K) LED109.1(K) LED125.1(K) LED141.1(K) LED157.1(K) LED173.1(K) LED189.1(K) LED205.1(K) LED221.1(K) LED237.1(K) LED253.1(K) Q13.2(D) R13.2 ; port M
N: LED14.1(K) LED30.1(K) LED46.1(K) LED62.1(K) LED78.1(K) LED94.1(K) LED110.1(K) LED126.1(K) LED142.1(K) LED158.1(K) LED174.1(K) LED190.1(K) LED206.1(K) LED222.1(K) LED238.1(K) LED254.1(K) Q14.2(D) R14.2 ; port N
O: LED15.1(K) LED31.1(K) LED47.1(K) LED63.1(K) LED79.1(K) LED95.1(K) LED111.1(K) LED127.1(K) LED143.1(K) LED159.1(K) LED175.1(K) LED191.1(K) LED207.1(K) LED223.1(K) LED239.1(K) LED255.1(K) Q15.2(D) R15.2 ; port O
P: LED16.1(K) LED32.1(K) LED48.1(K) LED64.1(K) LED80.1(K) LED96.1(K) LED112.1(K) LED128.1(K) LED144.1(K) LED160.1(K) LED176.1(K) LED192.1(K) LED208.1(K) LED224.1(K) LED240.1(K) LED256.1(K) Q16.2(D) R16.2 ; port P
NetC3_2: C3.2 R29.1 U2.11(φI) X1.1
NetC4_2: C4.2 R30.1 X1.2
NetDIP1_9: DIP1.9 R52.1 U6.3(A7)
NetDIP1_10: DIP1.10 R51.1 U6.25(A8)
NetDIP1_11: DIP1.11 R50.1 U6.24(A9)
NetDIP1_12: DIP1.12 R48.1 U6.21(A10)
NetDIP1_13: DIP1.13 R47.1 U6.23(A11)
NetDIP1_14: DIP1.14 R46.1 U6.2(A12)
NetDIP1_15: DIP1.15 R44.1 U6.26(A13)
NetDIP1_16: DIP1.16 R43.1 U6.1(A14)
NetJ1_1: J1.1 U2.7(Q4)
NetJ1_2: J1.2 U2.5(Q5)
NetJ1_3: J1.3 U2.4(Q6)
NetJ1_4: J1.4 U2.6(Q7)
NetJ1_5: J1.5 U2.14(Q8)
NetJ1_6: J1.6 U2.13(Q9)
NetJ1_7: J1.7 U2.15(Q10)
NetJ1_8: J1.8 U2.1(Q12)
NetJ1_9: J1.9 U2.2(Q13)
NetJ1_10: J1.10 U2.3(Q14)
NetJ2_1: J2.1 U4.7(QH)
NetJ2_2: J2.2 U4.6(QG)
NetJ2_3: J2.3 U4.5(QF)
NetQ1_1: Q1.1(G) U1.11(Q0)
NetQ2_1: Q2.1(G) U1.9(Q1)
NetQ3_1: Q3.1(G) U1.10(Q2)
NetQ4_1: Q4.1(G) U1.8(Q3)
NetQ5_1: Q5.1(G) U1.7(Q4)
NetQ6_1: Q6.1(G) U1.6(Q5)
NetQ7_1: Q7.1(G) U1.5(Q6)
NetQ8_1: Q8.1(G) U1.4(Q7)
NetQ9_1: Q9.1(G) U1.18(Q8)
NetQ10_1: Q10.1(G) U1.17(Q9)
NetQ11_1: Q11.1(G) U1.20(Q10)
NetQ12_1: Q12.1(G) U1.19(Q11)
NetQ13_1: Q13.1(G) U1.14(Q12)
NetQ14_1: Q14.1(G) U1.13(Q13)
NetQ15_1: Q15.1(G) U1.16(Q14)
NetQ16_1: Q16.1(G) U1.15(Q15)
NetQ17_1: Q17.1(G) R17.2 U3.18(Y0)
NetQ17_3: Q17.3(D) R19.1
NetQ18_2: Q18.2(GATE) U4.15(QA) U5.1(OE1#) U6.10(A0)
NetQ18_3: Q18.3(DRAIN) R21.1 U3.1(OE1#)
NetQ19_1: Q19.1(G) R20.1 U3.17(Y1)
NetQ19_3: Q19.3(D) R22.1
NetQ20_1: Q20.1(G) R23.1 U3.16(Y2)
NetQ20_3: Q20.3(D) R24.1
NetQ21_1: Q21.1(G) R25.1 U3.15(Y3)
NetQ21_3: Q21.3(D) R27.1
NetQ22_1: Q22.1(G) R69.1 U3.14(Y4)
NetQ22_3: Q22.3(D) R31.1
NetQ23_1: Q23.1(G) R32.1 U3.13(Y5)
NetQ23_3: Q23.3(D) R34.1
NetQ24_1: Q24.1(G) R36.1 U3.12(Y6)
NetQ24_3: Q24.3(D) R38.1
NetQ25_1: Q25.1(G) R39.1 U3.11(Y7)
NetQ25_3: Q25.3(D) R40.1
NetQ26_1: Q26.1(G) R41.1 U5.18(Y0)
NetQ26_3: Q26.3(D) R42.1
NetQ27_1: Q27.1(G) R45.1 U5.17(Y1)
NetQ27_3: Q27.3(D) R49.1
NetQ28_1: Q28.1(G) R53.1 U5.16(Y2)
NetQ28_3: Q28.3(D) R54.1
NetQ29_1: Q29.1(G) R57.1 U5.15(Y3)
NetQ29_3: Q29.3(D) R60.1
NetQ30_1: Q30.1(G) R61.1 U5.14(Y4)
NetQ30_3: Q30.3(D) R62.1
NetQ31_1: Q31.1(G) R63.1 U5.13(Y5)
NetQ31_3: Q31.3(D) R64.1
NetQ32_1: Q32.1(G) R65.1 U5.12(Y6)
NetQ32_3: Q32.3(D) R66.1
NetQ33_1: Q33.1(G) R67.1 U5.11(Y7)
NetQ33_3: Q33.3(D) R68.1
NetR18_2: R18.2 U2.12(MR)
NetR26_2: R26.2 U4.12(CCKEN#) U4.14(OE#)
NetR28_1: R28.1 U4.10(CCLR#)
NetR29_2: R29.2 R30.2 U2.10(φO#)
NetR33_1: R33.1 U6.27(WE#)
NetR35_1: R35.1 U6.22(OE#)
NetR37_1: R37.1 U6.20(CE#)
NetR55_1: R55.1 SW1.8 U6.4(A6)
NetR56_1: R56.1 SW1.7 U6.5(A5)
NetR58_1: R58.1 SW1.6
NetR59_1: R59.1 SW1.5
NetU1_2: U1.2(A0) U4.1(QB) U6.9(A1)
NetU1_3: U1.3(A1) U4.2(QC) U6.8(A2)
NetU1_21: U1.21(A2) U4.3(QD) U6.7(A3)
NetU1_22: U1.22(A3) U4.4(QE) U6.6(A4)
NetU2_9: U2.9(φO) U4.11(CCLK) U4.13(RCLK)
NetU3_2: U3.2(A0) U5.2(A0) U6.11(I/O0)
NetU3_3: U3.3(A1) U5.3(A1) U6.12(I/O1)
NetU3_4: U3.4(A2) U5.4(A2) U6.13(I/O2)
NetU3_5: U3.5(A3) U5.5(A3) U6.15(I/O3)
NetU3_6: U3.6(A4) U5.6(A4) U6.16(I/O4)
NetU3_7: U3.7(A5) U5.7(A5) U6.17(I/O5)
NetU3_8: U3.8(A6) U5.8(A6) U6.18(I/O6)
NetU3_9: U3.9(A7) U5.9(A7) U6.19(I/O7)

Not connected (* = marked no-connect by the designer): U4 9(RCO#)*

## Library data of the parts
C1 = 10uF: Manufacturer: TORCH(火炬); Manufacturer Part: CC1210Y5V16V106ZN; Contributor: lcsc; nameAlias: Value; Supplier: LCSC; Supplier Part: C54916872; JLCPCB Part Class: Extended Part; spicePre: C; spiceSymbolName: CC1210Y5V16V106ZN
C2 = 10nF: Manufacturer: HRE(芯声); Manufacturer Part: CSA0805C0G103J500MT; nameAlias: Value; Contributor: lcsc; Supplier: LCSC; Supplier Part: C49270298; JLCPCB Part Class: Extended Part; spicePre: C; spiceSymbolName: CSA0805C0G103J500MT
C3 C4 = 33pF: Manufacturer: Kyocera AVX; Manufacturer Part: 600F330JT250XT; nameAlias: Value; Contributor: lcsc; Supplier: LCSC; Supplier Part: C3838790; JLCPCB Part Class: Extended Part; spicePre: C; spiceSymbolName: 600F330JT250XT
C5 = 470nF: Manufacturer: Chengx(承兴); Manufacturer Part: kF474M050C05RR0VH2FP0; nameAlias: Value; Supplier: LCSC; Supplier Part: C45095; JLCPCB Part Class: Extended Part; spicePre: C; spiceSymbolName: 0.47uF 50V 4*5
C6 = 33uF: Manufacturer: Jianghai(南通江海); Manufacturer Part: ECR1HPT330MLL063011; nameAlias: Value; Contributor: LCSC; Supplier: LCSC; Supplier Part: C216549; JLCPCB Part Class: Extended Part; spicePre: C; spiceSymbolName: ECR1HPT330MLL063011
DIP1 = DIP switchEI-08: Manufacturer: Diptronics(圜达); Manufacturer Part: EI-08-V; Supplier: LCSC; Supplier Part: C90019; JLCPCB Part Class: Extended Part; spicePre: D; spiceSymbolName: DIP switchEI-08
J1 = HDR-M-2.54_1x10: Manufacturer: hanxia(韩下); Manufacturer Part: HX PZ-2005WV-1x10P; Contributor: LCEDA_Lib; Supplier Part: C42391526; Supplier: LCSC; spicePre: J; spiceSymbolName: HDR-M-2.54_1x10
J2 = HDR-M-2.54_1x3: Manufacturer: HDGC(华德共创); Manufacturer Part: 5557WRF-1X3P(HDGC4201WR-F-1X3P); Contributor: LCEDA_Lib; Supplier Part: C54557117; Supplier: LCSC; spicePre: J; spiceSymbolName: HDR-M-2.54_1x3
J3 = HDR-M-2.54_1x2: Contributor: LCEDA_Lib; Supplier Part: C124375; Supplier: LCSC; spicePre: J; spiceSymbolName: HDR-M-2.54_1x2
LED1-LED256 = 42-21A/GHC-YX1Y2N/1T: Manufacturer: EVERLIGHT(亿光); Contributor: lcsc; Supplier: LCSC; Supplier Part: C131211; Manufacturer Part: 42-21A/GHC-YX1Y2N/1T; JLCPCB Part Class: Extended Part; spicePre: L; spiceSymbolName: 42-21A/GHC-YX1Y2N/1T
Q1-Q16 = IRLZ44NPBF-MNS: Manufacturer: minos(迈诺斯); Contributor: lcsc; Supplier: LCSC; Supplier Part: C54839582; Manufacturer Part: IRLZ44NPBF-MNS; JLCPCB Part Class: Extended Part; spicePre: Q; spiceSymbolName: IRLZ44NPBF-MNS
Q17 Q19-Q33 = AO3401CI-ES: Manufacturer: ElecSuper(静芯); Contributor: lcsc; Supplier: LCSC; Supplier Part: C21713833; Manufacturer Part: AO3401CI-ES; JLCPCB Part Class: Extended Part; spicePre: Q; spiceSymbolName: AO3401CI-ES
Q18 = 2N7000-TA: Manufacturer: CJ(江苏长电/长晶); Contributor: LCSC; Supplier: LCSC; Supplier Part: C2910414; Manufacturer Part: 2N7000-TA; JLCPCB Part Class: Extended Part; spicePre: Q; spiceSymbolName: 2N7000-TA
R1-R18 R20 R21 R23 R25 R26 R28 R32 R33 R35-R37 R39 R41 R43-R48 R50-R53 R55-R59 R61 R63 R65 R67 R69 = 10k: Manufacturer Part: MFR-12FTF52-10K; Manufacturer: YAGEO(国巨); nameAlias: Value(Ω); Contributor: LCEDA_Lib; Supplier Part: C3356784; Supplier: LCSC; spicePre: R; spiceSymbolName: R_0603_EU
R19 R22 R24 R27 R31 R34 R38 R40 R42 R49 R54 R60 R62 R64 R66 R68 = 15Ω: Manufacturer: CCO(千志电子); Manufacturer Part: MF1/4W-15Ω±1% T; nameAlias: Value; Contributor: LCSC; Supplier: LCSC; Supplier Part: C119285; JLCPCB Part Class: Extended Part; spicePre: R; spiceSymbolName: MF1/4W-15Ω±1% T52
R29 = 1M: Manufacturer Part: FRC2512F1004TS; Manufacturer: FOJAN(富捷); nameAlias: Value(Ω); Contributor: LCEDA_Lib; Supplier Part: C3000673; Supplier: LCSC; spicePre: R; spiceSymbolName: R_0603_EU
R30 = 2.2k: Manufacturer Part: MF0204FTE52-2K2; Manufacturer: YAGEO(国巨); nameAlias: Value(Ω); Contributor: LCEDA_Lib; Supplier Part: C20611863; Supplier: LCSC; spicePre: R; spiceSymbolName: R_0603_EU
SW1 = DIP switchEI-04: Manufacturer: 圜达; Manufacturer Part: 拨码开关EI-04; Supplier: LCSC; Supplier Part: C99987; JLCPCB Part Class: Extended Part; spicePre: S; spiceSymbolName: DIP switchEI-04
U1 = XL74HC4514D: Manufacturer: XINLUDA(信路达); Contributor: lcsc; Supplier: LCSC; Supplier Part: C50202050; Manufacturer Part: XL74HC4514D; JLCPCB Part Class: Extended Part; spicePre: U; spiceSymbolName: XL74HC4514D
U2 = CD74HC4060M96: Manufacturer: TI(德州仪器); Supplier: LCSC; Manufacturer Part: CD74HC4060M96; Supplier Part: C134017; JLCPCB Part Class: Extended Part; spicePre: U; spiceSymbolName: CD74HC4060M96
U3 U5 = 74LVC541AD-Q100J: Manufacturer: Nexperia(安世); Contributor: LCSC; Supplier: LCSC; Supplier Part: C548810; Manufacturer Part: 74LVC541AD-Q100J; JLCPCB Part Class: Extended Part; spicePre: U; spiceSymbolName: 74LVC541AD-Q100J
U4 = SN74HC590ADR: Manufacturer: TI(德州仪器); Contributor: LCSC; Supplier: LCSC; Supplier Part: C2652997; Manufacturer Part: SN74HC590ADR; JLCPCB Part Class: Extended Part; spicePre: U; spiceSymbolName: SN74HC590ADR
U6 = AT28C256-15PU: Manufacturer: MICROCHIP(美国微芯); Contributor: LCSC; Supplier: LCSC; Supplier Part: C1348752; Manufacturer Part: AT28C256-15PU; JLCPCB Part Class: Extended Part; spicePre: U; spiceSymbolName: AT28C256-15PU
U7 = LM3940IMPX-3.3/NOPB: Manufacturer: TI(德州仪器); Contributor: LCSC; Supplier: LCSC; Supplier Part: C544820; Manufacturer Part: LM3940IMPX-3.3/NOPB; JLCPCB Part Class: Extended Part; spicePre: U; spiceSymbolName: LM3940IMPX-3.3/NOPB
X1 = 32.768kHz: Manufacturer: TKD(泰晶); Manufacturer Part: CD02K032768ACNBAEAE; nameAlias: Value; Contributor: lcsc; Supplier: LCSC; Supplier Part: C907564; JLCPCB Part Class: Extended Part; spicePre: X; spiceSymbolName: CD02K032768ACNBAEAE